# Altium schematic sheet ESP32-PICO-D4-MCU.SchDoc
size A4; SheetNumber: 1; SheetTotal: 6
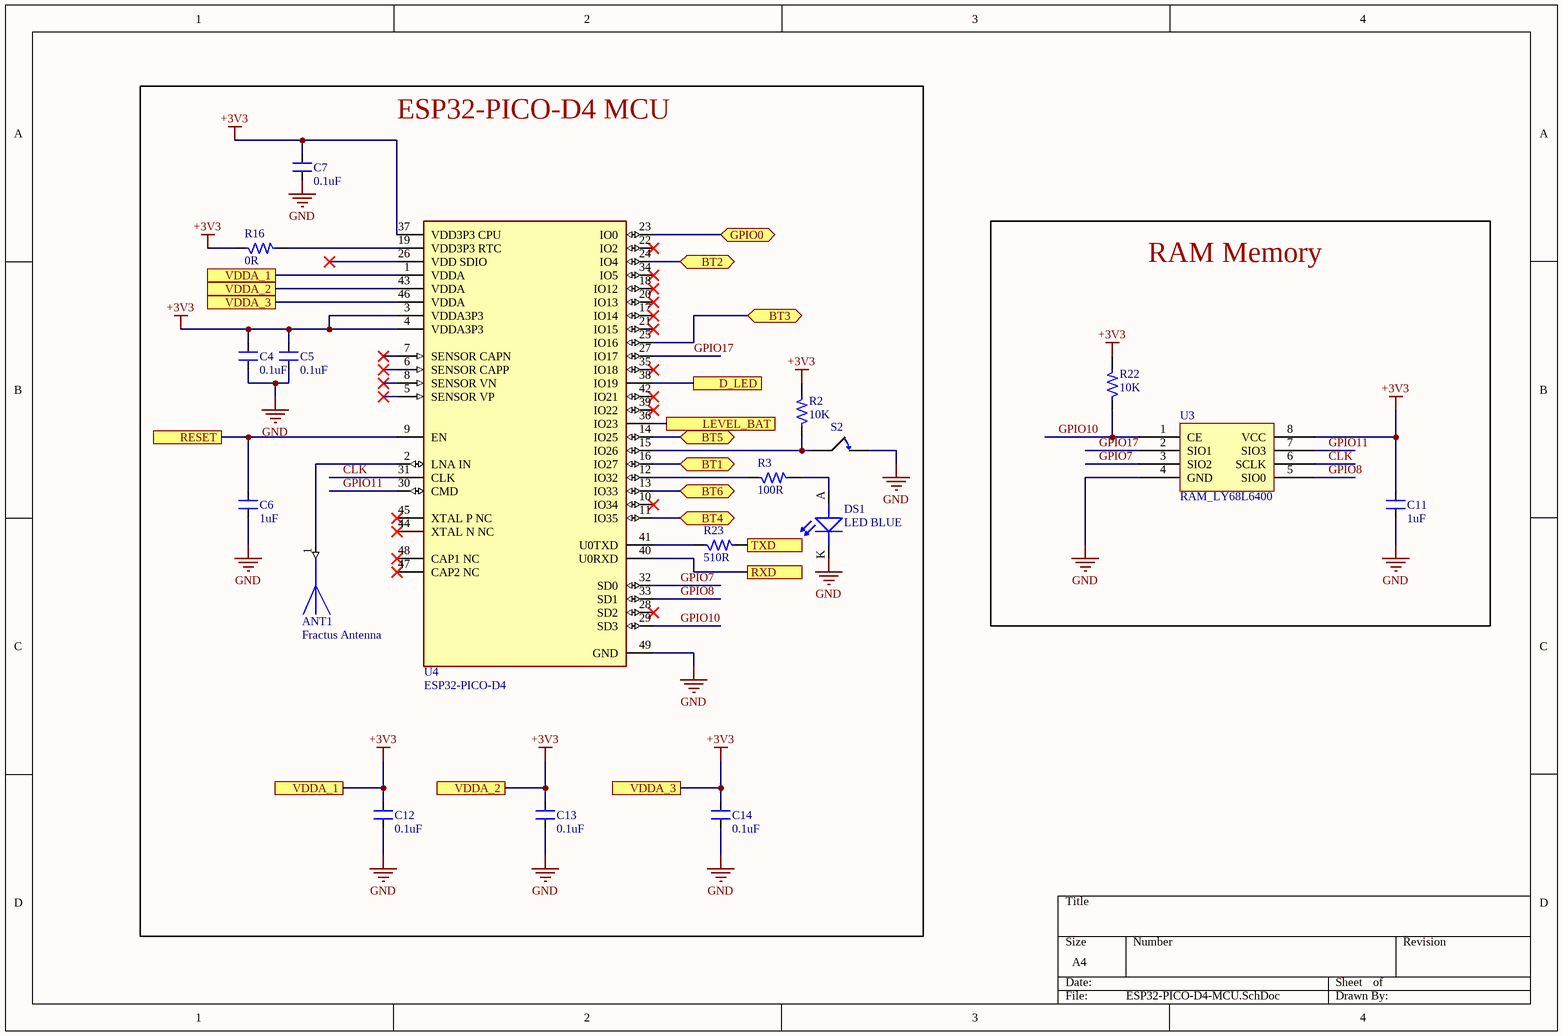
[diagram p0: ESP32-PICO-D4-MCU.SchDoc]

## Parts
ANT1  Fractus Antenna  [Fractus_Antenna_NN01-102]
C4  0.1uF  [CAP_0805]
C5  0.1uF  [CAP_0805]
C6  1uF  [CAP_0805]
C7  0.1uF  [CAP_0805]
C11  1uF  [CAP_0805]
C12  0.1uF  [CAP_0805]
C13  0.1uF  [CAP_0805]
C14  0.1uF  [CAP_0805]
DS1  LED BLUE  [LED_0805]
R2  10K  [RES_0805]
R3  100R  [RES_0805]
R16  0R  [RES_0805]
R22  10K  [RES_0805]
R23  510R  [RES_0805]
S2  Button Tactile Switch, NO 0.05 A 0.8mm  [Button8014X17N]  (value not drawn)
U3  RAM_LY68L6400  [RAM_LY68L6400]
U4  ESP32-PICO-D4  [Espressif_Systems_0_IPC_A]

## Blocks framed on the sheet
ESP32-PICO-D4 MCU: ANT1 C4-C7 C12-C14 DS1 R2 R3 R16 R23 S2 U4
RAM Memory: C11 R22 U3

## Ports
BT1 (bidir), BT2 (bidir), BT3 (bidir), BT4 (bidir), BT5 (bidir), BT6 (bidir), D_LED, GPIO0 (bidir), LEVEL_BAT, RESET, RXD, TXD, VDDA_1, VDDA_2, VDDA_3

## Nets
+3V3: C4.2 C5.2 C7.2 C11.2 C12.2 C13.2 C14.2 R2.2 R16.1 R22.2 U3.8(VCC) U4.1(VDDA) U4.3(VDDA3P3) U4.4(VDDA3P3) U4.37(VDD3P3_CPU) U4.43(VDDA) U4.46(VDDA) ; port VDDA_1, port VDDA_2, port VDDA_3
GND: C4.1 C5.1 C6.1 C7.1 C11.1 C12.1 C13.1 C14.1 DS1.K(CATHODE) S2.2 U3.4(GND) U4.49(GND)
BT1: U4.16(IO27) ; port BT1
BT2: U4.24(IO4) ; port BT2
BT3: U4.25(IO16) ; port BT3
BT4: U4.11(IO35) ; port BT4
BT5: U4.14(IO25) ; port BT5
BT6: U4.13(IO33) ; port BT6
CLK: U3.6(SCLK) U4.31(CLK)
D_LED: U4.38(IO19) ; port D_LED
GPIO0: U4.23(IO0) ; port GPIO0
GPIO7: U3.3(SIO2) U4.32(SD0)
GPIO8: U3.5(SIO0) U4.33(SD1)
GPIO10: R22.1 U3.1(CE) U4.29(SD3)
GPIO11: U3.7(SIO3) U4.30(CMD)
GPIO17: U3.2(SIO1) U4.27(IO17)
LEVEL_BAT: U4.36(IO23) ; port LEVEL_BAT
RESET: C6.2 U4.9(EN) ; port RESET
RXD: U4.40(U0RXD) ; port RXD
TXD: R23.2 ; port TXD
NetANT1_1: ANT1.1 U4.2(LNA_IN)
NetDS1_A: DS1.A(ANODE) R3.2
NetR2_1: R2.1 S2.1 U4.15(IO26)
NetR3_1: R3.1 U4.12(IO32)
NetR16_2: R16.2 U4.19(VDD3P3_RTC)
NetR23_1: R23.1 U4.41(U0TXD)

Not connected (* = marked no-connect by the designer): U4 5(SENSOR_VP)* 6(SENSOR_CAPP)* 7(SENSOR_CAPN)* 8(SENSOR_VN)* 10(IO34)* 17(IO14)* 18(IO12)* 20(IO13)* 21(IO15)* 22(IO2)* 26(VDD_SDIO)* 28(SD2)* 34(IO5)* 35(IO18)* 39(IO22)* 42(IO21)* 44(XTAL_N_NC)* 45(XTAL_P_NC)* 47(CAP2_NC)* 48(CAP1_NC)*

## Library data of the parts
ANT1 = ANT_2.45GHz_Bluetooth_WLAN_Zigbee_1.7dBi_NN01-102: 2.45GHz Bluetooth, WLAN, Zigbe Chip RF Antenna 2.4GHz ~ 2.5GHz 1.7dBi Solder Surface Mount
C4 C5 C7 C12-C14 = CAP_0.1uF-50V-10%-0805: 0.1µF ±10% 50V Ceramic Capacitor X7R 0805 (2012 Metric); Manufacturer: Samsung; Manufacturer Part Number: CL21B104KBCNNNC; Alternate Part Number-1: NA; Case/Package: 0805; Supplier-1: SIRICOM; Supplier Part Number-1: 0805B104K500CT
C6 C11 = CAP_1uF-50V-10%-0805_1: 1µF ±10% 50V Ceramic Capacitor X7R 0805 (2012 Metric); Manufacturer: Samsung; Manufacturer Part Number: CL21B104KBCNNNC; Alternate Part Number-1: NA; Case/Package: 0805; Supplier-1: SIRICOM; Supplier Part Number-1: 0805B104K500CT
DS1 = LED_BLUE-3V3-20mA-0805: Blue 470nm LED Indication - Discrete 3.3V 0805 (2012 Metric); Manufacturer: Vishay Lite-On; Manufacturer Part Number: LTST-C171TBKT; Alternate Part Number-1: NA; Case/Package: 0805; Supplier-1: SP ROAD; Supplier Part Number-1: LTST-C171TBKT
R2 R22 = RES_10K-0.125W-1%-0805: 10 kOhms ±1% 0.125W, 1/8W Chip Resistor 0805 (2012 Metric) Automotive AEC-Q200 Thick Film; Manufacturer: CTS; Manufacturer Part Number: WR08X1002FTL; Case/Package: 0805; Supplier-1: SIRICOM; Supplier Part Number-1: WR08X1002FTL; Alternate Part Number-1: WR08X1002FTL
R3 = RES_100R-0.125W-1%-0805: 100 Ohms ±1% 0.125W, 1/8W Chip Resistor 0805 (2012 Metric) Automotive AEC-Q200, Pulse Withstanding Thick Film; Manufacturer: Walsin; Manufacturer Part Number: WR08X1000FTL; Case/Package: 0805; Supplier-1: SIRICOM; Supplier Part Number-1: WR08X1000FTL; Alternate Part Number-1: WR08X1000FTL
R16 = RES_0R-0.125W-1%-0805: 0 Ohms Jumper 0.125W, 1/8W Chip Resistor 0805 (2012 Metric) Automotive AEC-Q200 Thick Film; Manufacturer: Walsin; Manufacturer Part Number: WR08X000PTL; Case/Package: 0805; Supplier-1: SIRICOM; Supplier Part Number-1: WR08X000PTL; Alternate Part Number-1: WR08X000PTL
R23 = RES_510R-0.125W-1%-0805: 510 Ohms ±1% 0.125W, 1/8W Chip Resistor 0805 (2012 Metric) Thin Film; Manufacturer: Yageo; Manufacturer Part Number: RT0805FRE07510RL; Alternate Part Number-1: NA; Case/Package: 0805; Supplier-1: SIRICOM; Supplier Part Number-1: WR08X5100FTL
S2 = Button Tactile Switch, NO 0.05 A 0.8mm: Manufacturer: C & K; Manufacturer Part No.: B3F1000; State: Normaly Open; Date Created: 25 February 2015; Creator: R Kanjee; RS Stock No.: 516-255